# Altium schematic sheet NavMergeBoard.SchDoc
size A
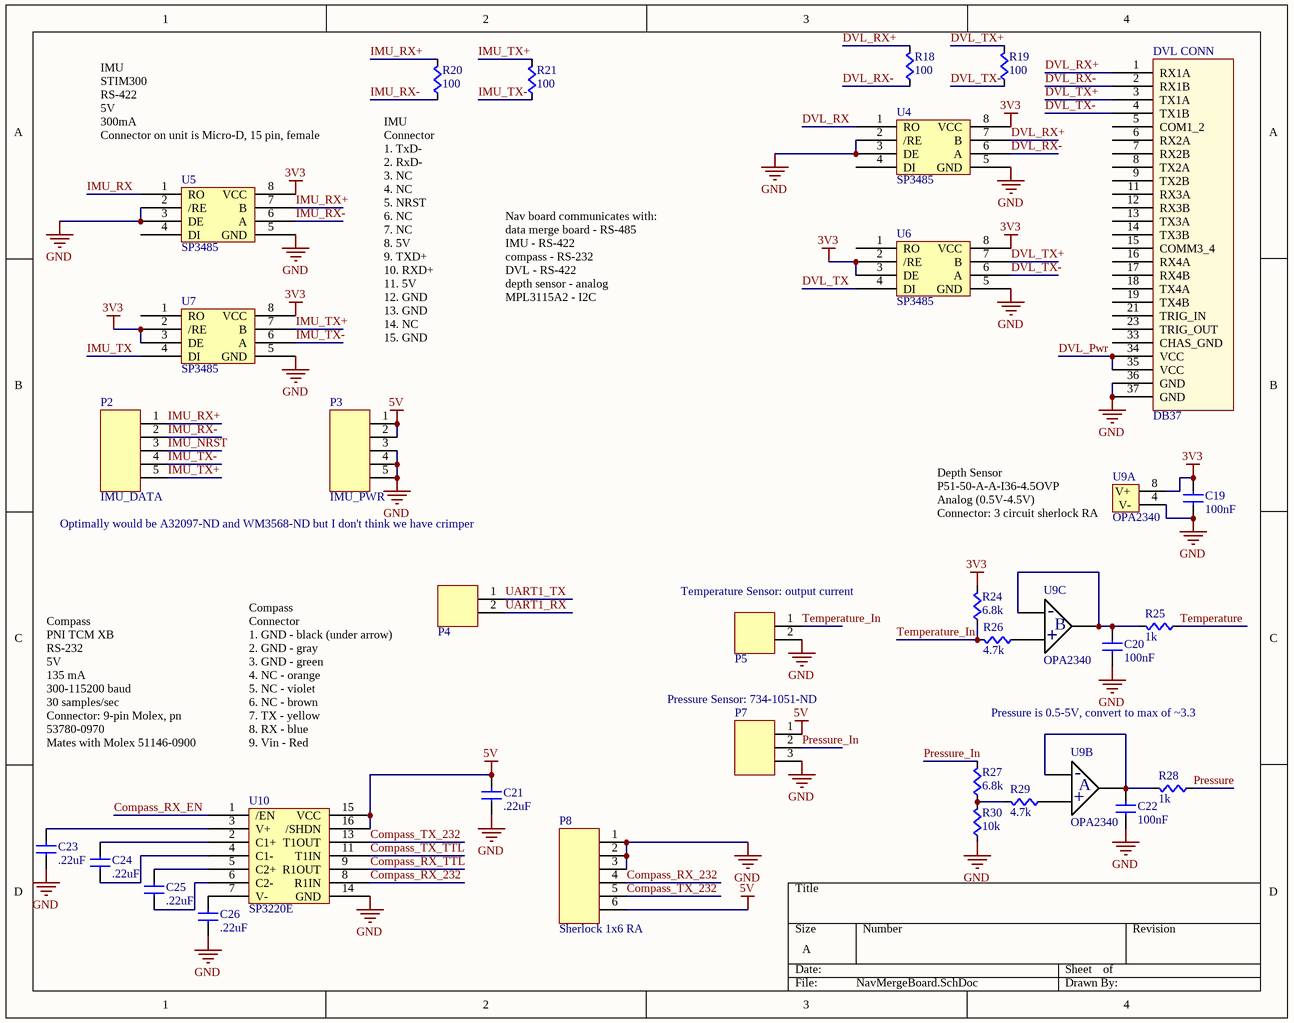
[diagram p0: NavMergeBoard.SchDoc]

## Parts
C19  value 100nF  [CAPC0603]  (hidden comment: Cap)
C20  value 100nF  [CAPC0603]  (hidden comment: Cap)
C21  value .22uF  [CAPC0603]  (hidden comment: Cap)
C22  value 100nF  [CAPC0603]  (hidden comment: Cap)
C23  value .22uF  [CAPC0603]  (hidden comment: Cap)
C24  value .22uF  [CAPC0603]  (hidden comment: Cap)
C25  value .22uF  [CAPC0603]  (hidden comment: Cap)
C26  value .22uF  [CAPC0603]  (hidden comment: Cap)
DVL_CONN  DB37  [DSUB37_ FEMALE]
P2  MOLEX-HDR-1x5-SHERLOCK_RA  [MOLEX-HDR-1X5-SHERLOCK- RA]  (value not drawn)
P3  MOLEX-HDR-1x5-SHERLOCK_RA  [MOLEX-HDR-1X5-SHERLOCK- RA]  (value not drawn)
P4  2-pin Horz Sherlock  [MOLEX-HDR-1X2-SHERLOCK-HORZ]  (value not drawn)
P5  2-pin Horz Sherlock  [MOLEX-HDR-1X2-SHERLOCK-HORZ]  (value not drawn)
P7  3pos RA sherlock connector  [MOLEX-HDR-1X3-SHERLOCK-RA]  (value not drawn)
P8  Sherlock 1x6 RA  [MOLEX-HDR-1X6-SHERLOCK- RA]
R18  value 100  [RES0603]  (hidden comment: Res)
R19  value 100  [RES0603]  (hidden comment: Res)
R20  value 100  [RES0603]  (hidden comment: Res)
R21  value 100  [RES0603]  (hidden comment: Res)
R24  value 6.8k  [RES0603]  (hidden comment: Res)
R25  value 1k  [RES0603]  (hidden comment: Res)
R26  value 4.7k  [RES0603]  (hidden comment: Res)
R27  value 6.8k  [RES0603]  (hidden comment: Res)
R28  value 1k  [RES0603]  (hidden comment: Res)
R29  value 4.7k  [RES0603]  (hidden comment: Res)
R30  value 10k  [RES0603]  (hidden comment: Res)
U4  SP3485  [SP3485]
U5  SP3485  [SP3485]
U6  SP3485  [SP3485]
U7  SP3485  [SP3485]
U9  OPA2340  [OPA2340]  (parts A,B,C of 3)
U10  SP3220E  [SP3220ECY-L/TR]

## Nets
3V3: C19.1(A) R24.1(A) U4.8(VCC) U5.8(VCC) U6.2(/RE) U6.3(DE) U6.8(VCC) U7.2(/RE) U7.3(DE) U7.8(VCC) U9.8(V+)
5V: C21.1(A) P3.1 P3.2 P7.1 P8.6 U10.15(VCC) U10.16(/SHDN)
GND: C19.2(B) C20.2(B) C21.2(B) C22.2(B) C23.2(B) C26.2(B) DVL_CONN.36(GND) DVL_CONN.37(GND) P3.3 P3.4 P3.5 P5.2 P7.3 P8.1 P8.2 P8.3 R30.2(B) U4.2(/RE) U4.3(DE) U4.5(GND) U5.2(/RE) U5.3(DE) U5.5(GND) U6.5(GND) U7.5(GND) U9.4(V-) U10.14(GND)
Compass_RX_232: P8.4 U10.8(R1IN)
Compass_RX_EN: U10.1(/EN)
Compass_RX_TTL: U10.9(R1OUT)
Compass_TX_232: P8.5 U10.13(T1OUT)
Compass_TX_TTL: U10.11(T1IN)
DVL_Pwr: DVL_CONN.34(VCC) DVL_CONN.35(VCC)
DVL_RX: U4.1(RO)
DVL_RX+: DVL_CONN.1(RX1A) R18.1(A) U4.7(B)
DVL_RX-: DVL_CONN.2(RX1B) R18.2(B) U4.6(A)
DVL_TX: U6.4(DI)
DVL_TX+: DVL_CONN.3(TX1A) R19.1(A) U6.7(B)
DVL_TX-: DVL_CONN.4(TX1B) R19.2(B) U6.6(A)
IMU_NRST: P2.3
IMU_RX: U5.1(RO)
IMU_RX+: P2.1 R20.1(A) U5.7(B)
IMU_RX-: P2.2 R20.2(B) U5.6(A)
IMU_TX: U7.4(DI)
IMU_TX+: P2.5 R21.1(A) U7.7(B)
IMU_TX-: P2.4 R21.2(B) U7.6(A)
Pressure: R28.2(B)
Pressure_In: P7.2 R27.1(A)
Temperature: R25.2(B)
Temperature_In: P5.1 R24.2(B) R26.1(A)
UART1_RX: P4.2
UART1_TX: P4.1
NetC20_1: C20.1(A) R25.1(A) U9.6(BIn-) U9.7(BOut)
NetC22_1: C22.1(A) R28.1(A) U9.1(AOut) U9.2(AIn-)
NetC23_1: C23.1(A) U10.3(V+)
NetC24_1: C24.1(A) U10.2(C1+)
NetC24_2: C24.2(B) U10.4(C1-)
NetC25_1: C25.1(A) U10.5(C2+)
NetC25_2: C25.2(B) U10.6(C2-)
NetC26_1: C26.1(A) U10.7(V-)
NetR26_2: R26.2(B) U9.5(BIn+)
NetR27_2: R27.2(B) R29.1(A) R30.1(A)
NetR29_2: R29.2(B) U9.3(AIn+)

Not connected (* = marked no-connect by the designer): DVL_CONN 5(COM1_2) 6(RX2A) 7(RX2B) 8(TX2A) 9(TX2B) 11(RX3A) 12(RX3B) 13(TX3A) 14(TX3B) 15(COMM3_4) 16(RX4A) 17(RX4B) 18(TX4A) 19(TX4B) 21(TRIG_IN) 23(TRIG_OUT) 33(CHAS_GND); U4 4(DI); U5 4(DI); U6 1(RO); U7 1(RO)

## Notes on the sheet
- (near U5) IMU
  STIM300
  RS-422
  5V
  300mA
  Connector on unit is Micro-D, 15 pin, female
- (near R20) IMU Connector
  1. TxD-
  2. RxD-
  3. NC
  4. NC
  5. NRST
  6. NC
  7. NC
  8. 5V
  9. TXD+
  10. RXD+
  11. 5V
  12. GND
  13. GND
  14. NC
  15. GND
- Nav board communicates with:
  data merge board - RS-485
  IMU - RS-422
  compass - RS-232
  DVL - RS-422
  depth sensor - analog
  MPL3115A2 - I2C
- (near P2) IMU_DATA
- (near P3) IMU_PWR
- Optimally would be A32097-ND and WM3568-ND but I don't think we have crimper
- Depth Sensor
  P51-50-A-A-I36-4.5OVP
  Analog (0.5V-4.5V)
  Connector: 3 circuit sherlock RA
- (near P5) Temperature Sensor: output current
- (near P7) Pressure Sensor: 734-1051-ND
- Compass
  PNI TCM XB
  RS-232
  5V
  135 mA
  300-115200 baud
  30 samples/sec
  Connector: 9-pin Molex, pn 53780-0970
  Mates with Molex 51146-0900
- Compass
  Connector
  1. GND - black (under arrow)
  2. GND - gray
  3. GND - green
  4. NC - orange
  5. NC - violet
  6. NC - brown
  7. TX - yellow
  8. RX - blue
  9. Vin - Red
- Pressure is 0.5-5V, convert to max of ~3.3
- (in symbol OPA2340, part B) -; A; +
- (in symbol OPA2340, part C) -; B; +

## Library data of the parts
DVL_CONN = DVLCONN: DVL Connector using DSUB37; Manufacturer: FCI; Manufacturer Part Number: 10090098-S374VLF; Supplier 1: Digikey; Supplier Part Number 1: 609-4001-ND
P2 P3 = MOLEX-HDR-1x5-SHERLOCK_RA: Header, Molex, 2mm Pitch Sherlock Header, Single Row, Vertical, 5 Circuits, Length 3.3mm, 0353620550; Manufacturer Part Number: 0353630560; Supplier Part Number 1: WM18934-ND; Supplier 1: Digikey; Manufacturer: Molex
P4 P5 = MOLEX-HDR-1x2-SHERLOCK_RA: Header, Molex, 2mm Pitch Sherlock Header, Single Row, Horizontal, 2 Circuits, Length 3.3mm,  0353630260; Manufacturer: Molex Inc; Manufacturer Part Number: 0353630260; Supplier Part Number 1: WM18931-ND; Supplier 1: Digi-Key
P7 = MOLEX-HDR-1x3-SHERLOCK_RA: Header, Molex, 2mm Pitch Sherlock Header, Single Row, Right Angle 3 Circuits, Length 3.3mm; Manufacturer Part Number: 35363-0360; Manufacturer: Molex Connector Corporation; Supplier Part Number 1: WM18932-ND; Supplier 1: Digi-Key
P8 = MOLEX-HDR-1x6-SHERLOCK_RA: CONN HEADER 6POS 2MM R/A TIN; Supplier 1: Digi-Key; Supplier Part Number 1: WM18935-ND
U4-U7 = SP3485: IC TXRX RS485 HALF DUPLEX 8NSOIC; Supplier 1: Digi-Key; Supplier Part Number 1: 1016-1817-1-ND
U9 = OPA2340: IC OPAMP GP 5.5MHZ RRO 8SOIC; Supplier 1: Digi-Key; Supplier Part Number 1: 296-26254-1-ND
U10 = SP3220E: IC DVR/RCVR RS232 ESD 16TSSOP; Supplier 1: Digi-Key; Supplier Part Number 1: 1016-1920-1-ND
C19-C26 = Cap: Supplier 1: Digi-Key
  C19 C20 C22: Supplier Part Number 1: 1276-1000-1-ND
  C21 C23-C26: Supplier Part Number 1: 587-1246-1-ND
R18-R21 R24-R30 = Res: Supplier 1: Digi-Key
  R18-R21: Supplier Part Number 1: P100GCT-ND
  R24 R27: Supplier Part Number 1: RHM6.8KCFCT-ND
  R25 R28: Supplier Part Number 1: P1.0KGCT-ND
  R26 R29: Supplier Part Number 1: P4.7KGCT-ND
  R30: Supplier Part Number 1: RMCF0603JT10K0CT-ND